# Altium schematic sheet STM32G473CET6_PINOUT.SchDoc
size C; SheetNumber: 8; SheetTotal: 9
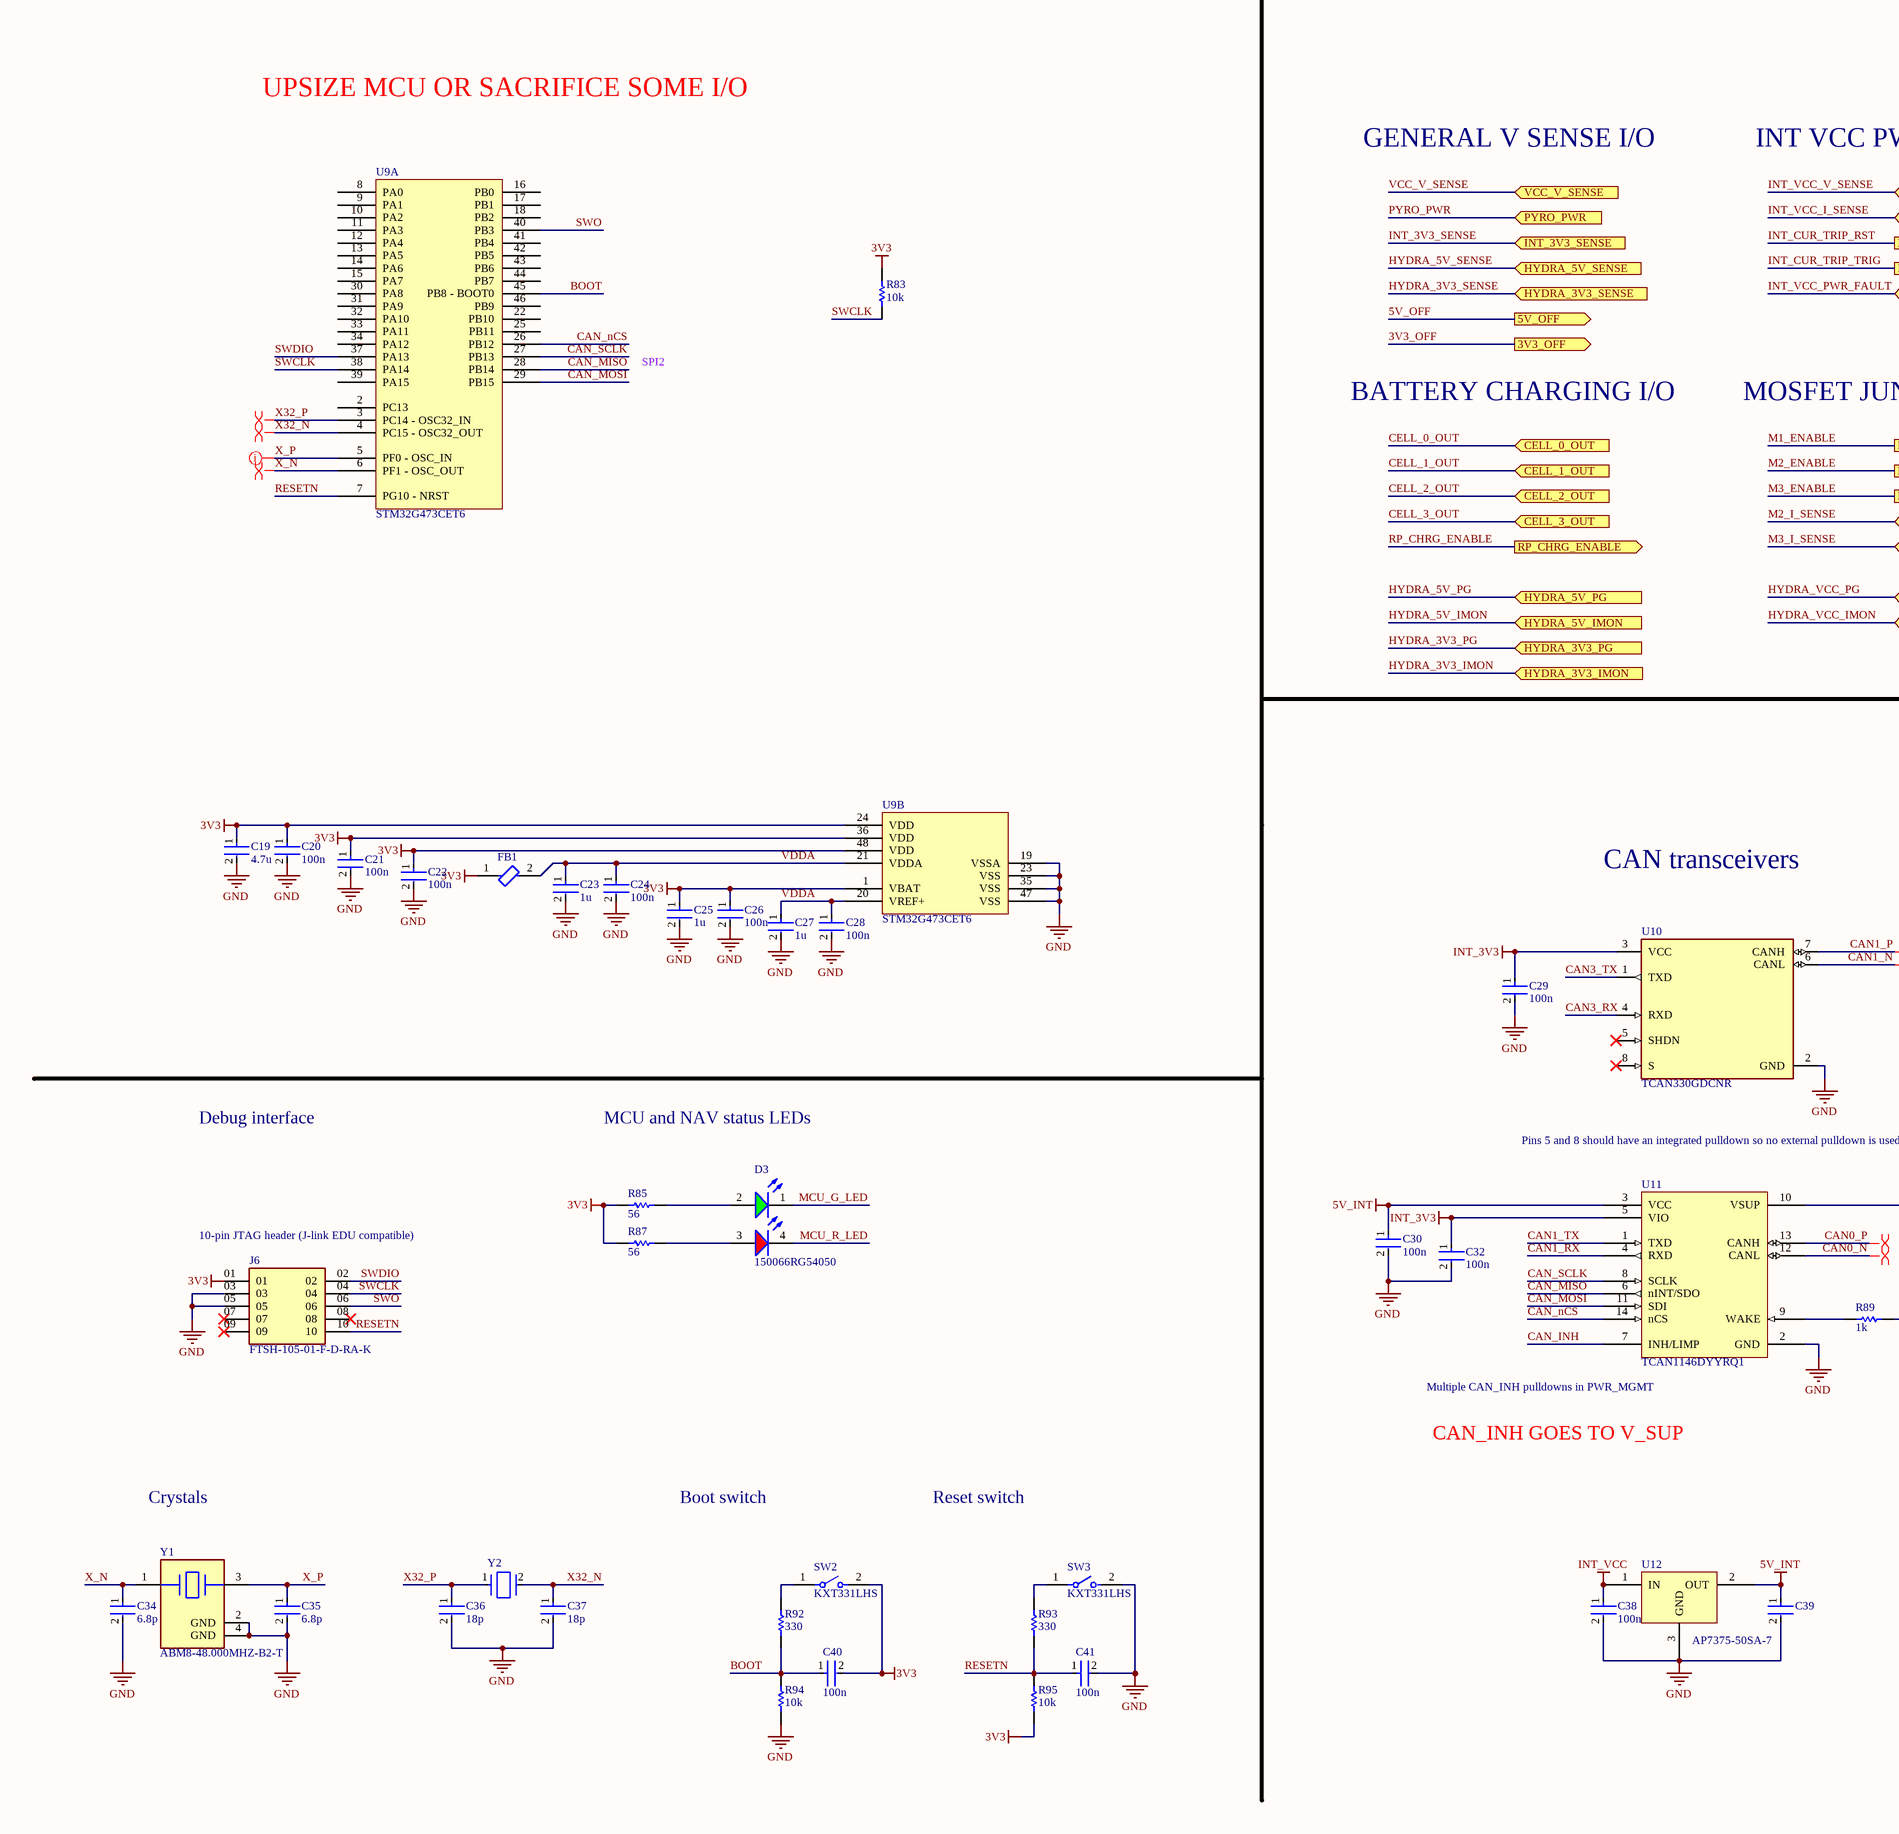
[diagram p0: STM32G473CET6_PINOUT.SchDoc, left]
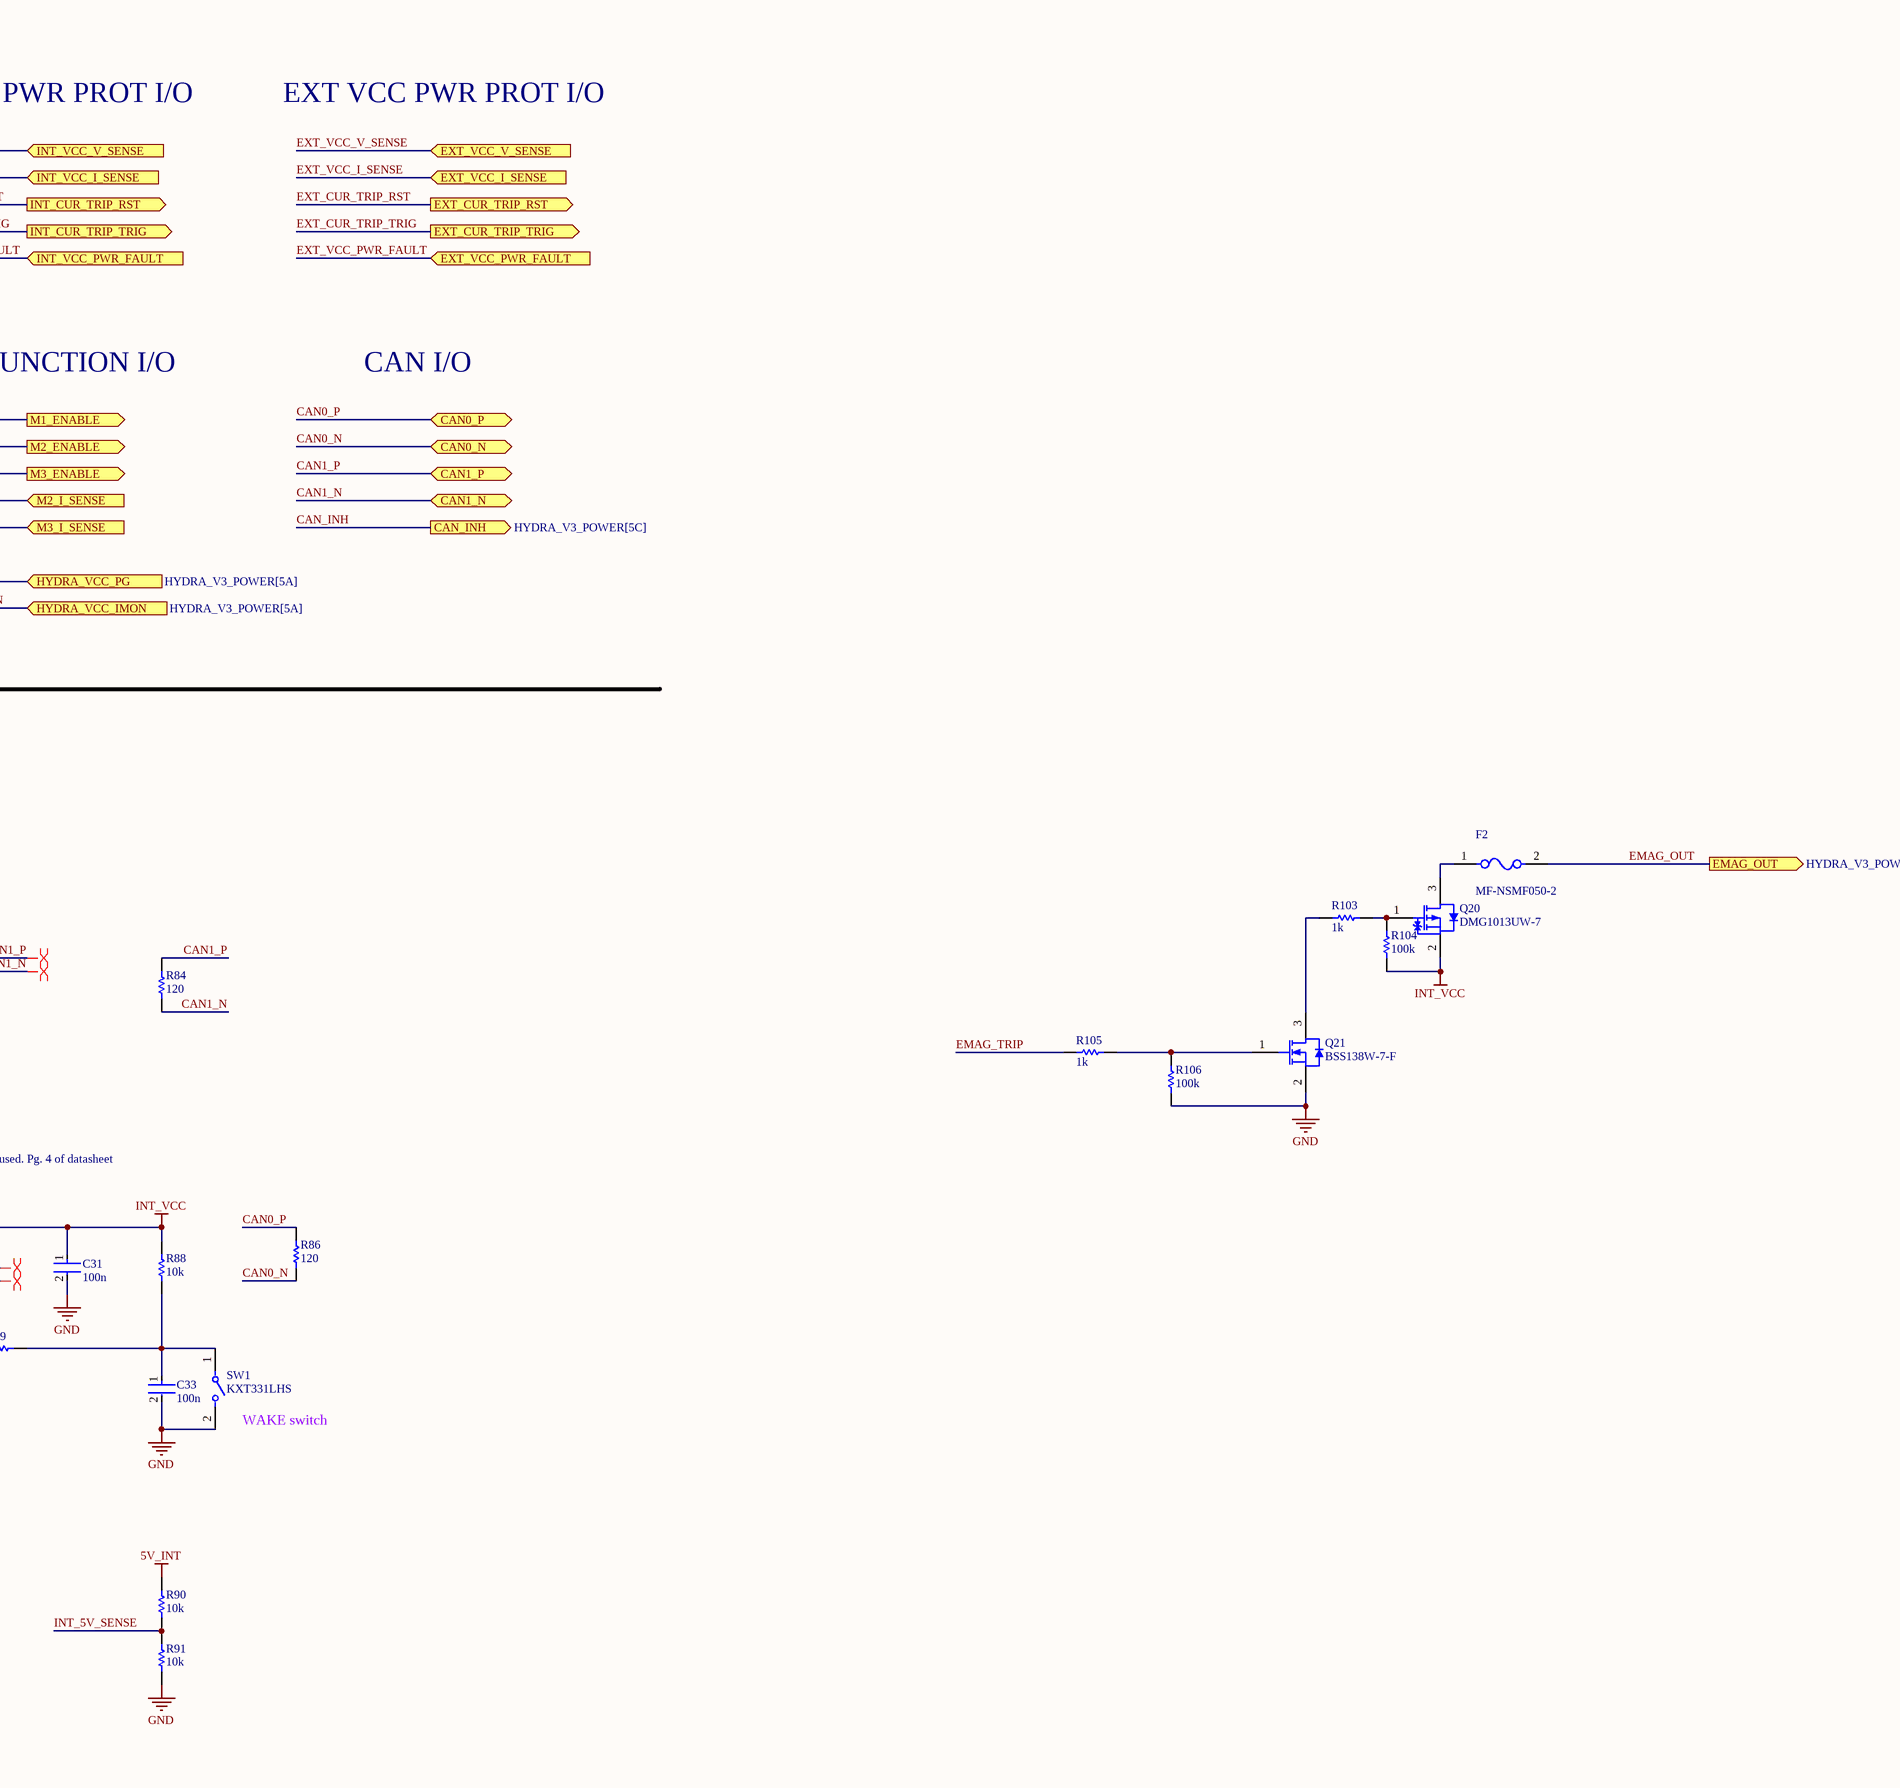
[diagram p1: STM32G473CET6_PINOUT.SchDoc, right]

## Parts
C19  4.7u  [FP-0402-L_1_0_0_05-W_0_5-IPC_A]
C20  100n  [FP-0402-L_1_0_0_05-W_0_5-IPC_A]
C21  100n  [FP-0402-L_1_0_0_05-W_0_5-IPC_A]
C22  100n  [FP-0402-L_1_0_0_05-W_0_5-IPC_A]
C23  1u  [FP-0402-L_1_0_0_05-W_0_5-IPC_A]
C24  100n  [FP-0402-L_1_0_0_05-W_0_5-IPC_A]
C25  1u  [FP-0402-L_1_0_0_05-W_0_5-IPC_A]
C26  100n  [FP-0402-L_1_0_0_05-W_0_5-IPC_A]
C27  1u  [FP-0402-L_1_0_0_05-W_0_5-IPC_A]
C28  100n  [FP-0402-L_1_0_0_05-W_0_5-IPC_A]
C29  100n  [FP-0402-L_1_0_0_05-W_0_5-IPC_A]
C30  100n  [FP-0402-L_1_0_0_05-W_0_5-IPC_A]
C31  100n  [FP-0402-L_1_0_0_05-W_0_5-IPC_A]
C32  100n  [FP-0402-L_1_0_0_05-W_0_5-IPC_A]
C33  100n  [FP-0402-L_1_0_0_05-W_0_5-IPC_A]
C34  6.8p  [FP-0402-L_1_0_0_05-W_0_5-IPC_A]
C35  6.8p  [FP-0402-L_1_0_0_05-W_0_5-IPC_A]
C36  18p  [FP-0402-L_1_0_0_05-W_0_5-IPC_A]
C37  18p  [FP-0402-L_1_0_0_05-W_0_5-IPC_A]
C38  100n  [FP-0402-L_1_0_0_05-W_0_5-IPC_A]
C39  CL05A106MP5NUNC  [FP-CL05A106MP5NUNC-MFG]  (value not drawn)
C40  100n  [FP-0402-L_1_0_0_05-W_0_5-IPC_A]
C41  100n  [FP-0402-L_1_0_0_05-W_0_5-IPC_A]
D3  150066RG54050  [WL-SBCD_0606]
F2  MF-NSMF050-2  [FP-MF-NSMF050-2-MFG]
FB1  BLM15PX601SN1D  [FP-BLM15-0_05-MFG]  (value not drawn)
J6  FTSH-105-01-F-D-RA-K  [FTSH-105-01-F-D-RA-K-Footprint-1]
Q20  DMG1013UW-7  [DIOD-SOT323-3_V]
Q21  BSS138W-7-F  [DIOD-SOT323-3_V]
R83  10k  [R0603B]
R84  120  [R0603B]
R85  56  [R0603B]
R86  120  [R0603B]
R87  56  [R0603B]
R88  10k  [R0603B]
R89  1k  [R0603B]
R90  10k  [R0603B]
R91  10k  [R0603B]
R92  330  [R0603B]
R93  330  [R0603B]
R94  10k  [R0603B]
R95  10k  [R0603B]
R103  1k  [R0603B]
R104  100k  [R0603B]
R105  1k  [R0603B]
R106  100k  [R0603B]
SW1  KXT331LHS  [FP-KXT331LHS-MFG]
SW2  KXT331LHS  [FP-KXT331LHS-MFG]
SW3  KXT331LHS  [FP-KXT331LHS-MFG]
U9  STM32G473CET6  [TSQFP50P900X900X160-48N]  (parts A,B of 2)
U10  TCAN330GDCNR  [FP-DCN0008A-MFG]
U11  TCAN1146DYYRQ1  [TCAN1146DYYRQ1-Footprint-1]
U12  AP7375-50SA-7  [AP7375-50SA-7-Footprint-1]
Y1  ABM8-48.000MHZ-B2-T  [FP-ABM8-MFG]
Y2  ECS-.327-12.5-1210-TR  [FP-ECX-1210-MFG]  (value not drawn)

## Ports
3V3_OFF (out, see HYDRA_V3_POWER[5B], HYDRA_REGULATORS[1A]), 5V_OFF (out, see HYDRA_V3_POWER[5B], HYDRA_REGULATORS[1A]), CAN0_N (bidir, see HYDRA_V3_POWER[5C]), CAN0_P (bidir, see HYDRA_V3_POWER[5C]), CAN1_N (bidir, see HYDRA_V3_POWER[5C]), CAN1_P (bidir, see HYDRA_V3_POWER[5C]), CAN_INH (out, see HYDRA_V3_POWER[5C]), CELL_0_OUT (in, see HYDRA_V3_POWER[5C], CELL_SENSE[4A]), CELL_1_OUT (in, see HYDRA_V3_POWER[5C], CELL_SENSE[4A]), CELL_2_OUT (in, see HYDRA_V3_POWER[5C], CELL_SENSE[4A]), CELL_3_OUT (in, see HYDRA_V3_POWER[5C], CELL_SENSE[4A]), EMAG_OUT (out, see HYDRA_V3_POWER[5C]), EXT_CUR_TRIP_RST (out, see HYDRA_V3_POWER[5C]), EXT_CUR_TRIP_TRIG (out, see HYDRA_V3_POWER[5C]), EXT_VCC_I_SENSE (in, see HYDRA_V3_POWER[5C]), EXT_VCC_PWR_FAULT (in, see HYDRA_V3_POWER[5C]), EXT_VCC_V_SENSE (in, see HYDRA_V3_POWER[5C]), HYDRA_3V3_IMON (in, see HYDRA_V3_POWER[5B]), HYDRA_3V3_PG (in, see HYDRA_V3_POWER[5B]), HYDRA_3V3_SENSE (in, see HYDRA_V3_POWER[5B]), HYDRA_5V_IMON (in, see HYDRA_V3_POWER[5B]), HYDRA_5V_PG (in, see HYDRA_V3_POWER[5B]), HYDRA_5V_SENSE (in, see HYDRA_V3_POWER[5B]), HYDRA_VCC_IMON (in, see HYDRA_V3_POWER[5A]), HYDRA_VCC_PG (in, see HYDRA_V3_POWER[5A]), INT_3V3_SENSE (in, see HYDRA_V3_POWER[5A], INT_REG[3B]), INT_CUR_TRIP_RST (out, see HYDRA_V3_POWER[5B]), INT_CUR_TRIP_TRIG (out, see HYDRA_V3_POWER[5B]), INT_VCC_I_SENSE (in, see HYDRA_V3_POWER[5B]), INT_VCC_PWR_FAULT (in, see HYDRA_V3_POWER[5B]), INT_VCC_V_SENSE (in, see HYDRA_V3_POWER[5B]), M1_ENABLE (out, see HYDRA_V3_POWER[5B]), M2_ENABLE (out, see HYDRA_V3_POWER[5B]), M2_I_SENSE (in, see HYDRA_V3_POWER[5C], MOSFET_JUNCTION[5A]), M3_ENABLE (out, see HYDRA_V3_POWER[5B]), M3_I_SENSE (in, see HYDRA_V3_POWER[5C], MOSFET_JUNCTION[5C]), PYRO_PWR (in, see HYDRA_V3_POWER[5A]), RP_CHRG_ENABLE (out, see HYDRA_V3_POWER[5C]), VCC_V_SENSE (in, see HYDRA_V3_POWER[5A], INT_REG[3C])

## Nets
3V3: C19.1 C20.1 C21.1 C22.1 C25.1 C26.1 C40.2 FB1.1 J6.01 R83.2 R85.2 R87.2 R95.1 SW2.2 U9.1(VBAT) U9.24(VDD) U9.36(VDD) U9.48(VDD)
5V_INT: C30.1 C39.1 R90.2 U11.3(VCC) U12.2(OUT)
GND: C19.2 C20.2 C21.2 C22.2 C23.2 C24.2 C25.2 C26.2 C27.2 C28.2 C29.2 C30.2 C31.2 C32.2 C33.2 C34.2 C35.2 C36.2 C37.2 C38.2 C39.2 C41.2 J6.03 J6.05 Q21.2(S) R91.1 R94.1 R106.1 SW1.2 SW3.2 U9.19(VSSA) U9.23(VSS) U9.35(VSS) U9.47(VSS) U10.2(GND) U11.2(GND) U12.3(GND) Y1.2(GND) Y1.4(GND)
INT_3V3: C29.1 C32.1 U10.3(VCC) U11.5(VIO)
INT_VCC: C31.1 C38.1 Q20.2(S) R88.2 R104.2 U11.10(VSUP) U12.1(IN)
3V3_OFF: port 3V3_OFF
5V_OFF: port 5V_OFF
BOOT: C40.1 R92.1 R94.2 U9.45(PB8_-_BOOT0)
CAN0_N: R86.1 U11.12(CANL) ; port CAN0_N
CAN0_P: R86.2 U11.13(CANH) ; port CAN0_P
CAN1_N: R84.1 U10.6(CANL) ; port CAN1_N
CAN1_P: R84.2 U10.7(CANH) ; port CAN1_P
CAN1_RX: U11.4(RXD)
CAN1_TX: U11.1(TXD)
CAN3_RX: U10.4(RXD)
CAN3_TX: U10.1(TXD)
CAN_INH: U11.7(INH/LIMP) ; port CAN_INH
CAN_MISO: U9.28(PB14) U11.6(nINT/SDO)
CAN_MOSI: U9.29(PB15) U11.11(SDI)
CAN_nCS: U9.26(PB12) U11.14(nCS)
CAN_SCLK: U9.27(PB13) U11.8(SCLK)
CELL_0_OUT: port CELL_0_OUT
CELL_1_OUT: port CELL_1_OUT
CELL_2_OUT: port CELL_2_OUT
CELL_3_OUT: port CELL_3_OUT
EMAG_OUT: F2.2 ; port EMAG_OUT
EMAG_TRIP: R105.2
EXT_CUR_TRIP_RST: port EXT_CUR_TRIP_RST
EXT_CUR_TRIP_TRIG: port EXT_CUR_TRIP_TRIG
EXT_VCC_I_SENSE: port EXT_VCC_I_SENSE
EXT_VCC_PWR_FAULT: port EXT_VCC_PWR_FAULT
EXT_VCC_V_SENSE: port EXT_VCC_V_SENSE
HYDRA_3V3_IMON: port HYDRA_3V3_IMON
HYDRA_3V3_PG: port HYDRA_3V3_PG
HYDRA_3V3_SENSE: port HYDRA_3V3_SENSE
HYDRA_5V_IMON: port HYDRA_5V_IMON
HYDRA_5V_PG: port HYDRA_5V_PG
HYDRA_5V_SENSE: port HYDRA_5V_SENSE
HYDRA_VCC_IMON: port HYDRA_VCC_IMON
HYDRA_VCC_PG: port HYDRA_VCC_PG
INT_3V3_SENSE: port INT_3V3_SENSE
INT_5V_SENSE: R90.1 R91.2
INT_CUR_TRIP_RST: port INT_CUR_TRIP_RST
INT_CUR_TRIP_TRIG: port INT_CUR_TRIP_TRIG
INT_VCC_I_SENSE: port INT_VCC_I_SENSE
INT_VCC_PWR_FAULT: port INT_VCC_PWR_FAULT
INT_VCC_V_SENSE: port INT_VCC_V_SENSE
M1_ENABLE: port M1_ENABLE
M2_ENABLE: port M2_ENABLE
M2_I_SENSE: port M2_I_SENSE
M3_ENABLE: port M3_ENABLE
M3_I_SENSE: port M3_I_SENSE
MCU_G_LED: D3.1(K)
MCU_R_LED: D3.4(K)
PYRO_PWR: port PYRO_PWR
RESETN: C41.1 J6.10 R93.1 R95.2 U9.7(PG10_-_NRST)
RP_CHRG_ENABLE: port RP_CHRG_ENABLE
SWCLK: J6.04 R83.1 U9.38(PA14)
SWDIO: J6.02 U9.37(PA13)
SWO: J6.06 U9.40(PB3)
VCC_V_SENSE: port VCC_V_SENSE
VDDA: C23.1 C24.1 C27.1 C28.1 FB1.2 U9.20(VREF+) U9.21(VDDA)
X32_N: C37.1 U9.4(PC15_-_OSC32_OUT) Y2.2(Out/In)
X32_P: C36.1 U9.3(PC14_-_OSC32_IN) Y2.1(In/Out)
X_N: C34.1 U9.6(PF1_-_OSC_OUT) Y1.1
X_P: C35.1 U9.5(PF0_-_OSC_IN) Y1.3
NetC33_1: C33.1 R88.1 R89.1 SW1.1
NetD3_2: D3.2(A) R85.1
NetD3_3: D3.3(A) R87.1
NetF2_1: F2.1 Q20.3(D)
NetQ20_1: Q20.1(G) R103.1 R104.1
NetQ21_1: Q21.1(G) R105.1 R106.2
NetQ21_3: Q21.3(D) R103.2
NetR89_2: R89.2 U11.9(WAKE)
NetR92_2: R92.2 SW2.1
NetR93_2: R93.2 SW3.1

Not connected (* = marked no-connect by the designer): J6 07* 08* 09*; U9 2(PC13) 8(PA0) 9(PA1) 10(PA2) 11(PA3) 12(PA4) 13(PA5) 14(PA6) 15(PA7) 16(PB0) 17(PB1) 18(PB2) 22(PB10) 25(PB11) 30(PA8) 31(PA9) 32(PA10) 33(PA11) 34(PA12) 39(PA15) 41(PB4) 42(PB5) 43(PB6) 44(PB7) 46(PB9); U10 5(SHDN)* 8(S)*

## Layout directives
differential pair: CAN1_N, CAN1_P, X32_N, X32_P, X_N, X_P
differential pair; differential pair class 120DIFF: CAN0_N, CAN0_P

## Notes on the sheet
- UPSIZE MCU OR SACRIFICE SOME I/O
- GENERAL V SENSE I/O
- INT VCC PWR PROT I/O
- EXT VCC PWR PROT I/O
- SPI2
- BATTERY CHARGING I/O
- MOSFET JUNCTION I/O
- CAN I/O
- CAN transceivers
- Debug interface
- MCU and NAV status LEDs
- Pins 5 and 8 should have an integrated pulldown so no external pulldown is used. Pg. 4 of datasheet
- (near J6) 10-pin JTAG header (J-link EDU compatible)
- (near U11) Multiple CAN_INH pulldowns in PWR_MGMT
- (near SW1) WAKE switch
- CAN_INH GOES TO V_SUP
- Crystals
- Boot switch
- Reset switch

## Library data of the parts
C19-C38 C40 C41 = CMP-001-00058-1: LARGE PADS, 0402 CAP, CHANGE COMMENT TO MATCH REAL P/N; Capacitor Type: Ceramic; Min Operating Temperature: -55°C; Mounting Technology: Surface Mount; Pins: 2; Case/Package: 0402; RoHS Compliant: Yes; Max Operating Temperature: 85°C
C39 = CMP-13271-000002-1: CAP CER 10UF 10V X5R 0402; Manufacturer: Samsung; Temperature Coefficient: 15%; Tolerance: 20%; Material: Ceramic; Octopart: https://octopart.com/cl05a106mp5nunc-samsung-22457395; Voltage Rating: 10V; RoHS: TRUE; Value: 10uF; Height: 0.7mm; Digikey Description: CAP CER 10UF 10V X5R 0402; Automotive: No; Package: CL05A106MP5NUNC; Device Class L1: Passive Components; Capacitance: 10uF; Temperature Range High: +85°C; ComponentLink2Description: Datasheet; Device Class L2: Capacitors; Temperature Characteristic: X5R; Manufacturer Part Number: CL05A106MP5NUNC; Temperature: -55°C to +85°C; ComponentLink2URL: http://www.samsungsem.com/kr/support/product-search/mlcc/__icsFiles/afieldfile/2019/05/10/19-CL05A106MP5NUNC.pdf; Device Class L3: Ceramic Capacitors; Category: Cap; Temperature Range Low: -55°C; Ipc Land Pattern Name: CAPC10050X50; Lead Free: Yes
D3 = CMP-004-00040-2: Led, Red/Grn, 180Mcd/230Mcd, 624Nm/525Nm Rohs Compliant: Yes; Source: rgled.SchLib; Component Type: Standard; Design Item ID: CMP-004-00034-2; Pins: 4
F2 = CMP-07400-000036-1: PTC RESET FUSE 13.2V 500MA 1206; Manufacturer: Bourns; Resistance: 0.15-0.7Ω; Hold Current: 0.5A; Trip Current: 1A; Current Rating: 100A; Value: 0.15-0.7Ω; Automotive Grade: Grade 3; Trip Time: 0.1s; Temperature Range Low: -40°C; Temperature: -40°C to +85°C; Digikey Description: PTC RESET FUSE 13.2V 500MA 1206; Ambient Temperature Range Low: -40°C; RoHS: TRUE; Device Class L2: PTC Resettable Fuses; Octopart: https://octopart.com/mf-nsmf050-2-bourns-34532; ComponentLink2Description: Datasheet; Voltage Rating: 13.2V; Category: Fuse; ComponentLink2URL: https://www.bourns.com/docs/product-datasheets/mfnsmf.pdf?sfvrsn=39c76af6_14; Mouser Description: Resettable Fuses - PPTC 0.50A 13.2V 0.15ohm 1206 Footprint; Temperature Range High: +85°C; Device Class L1: Circuit Protection; Device Class L3: unset; Automotive: Yes; Package: MF-NSMF050-2; Ambient Temperature Range High: +85°C; Height: 0.85mm; Manufacturer Part Number: MF-NSMF050-2; Lead Free: Yes
FB1 = CMP-0686-00252-4: Chip Ferrite Bead, 0402, 600Ω @ 100MHz, 0.23Ω, 25%, 900mA; Number of Circuits: 1; Impedance: 600R; DC Resistance (DCR): 230mR; Material: Steel; Length: 1mm; Package Quantity: 10000; Height: 0.5mm; Width: 0.5mm; Max DC Current: 900mA; Number of Lines: 1; Termination: SMD/SMT; Packaging: Tape and Reel; Lead Free: Lead Free; Min Operating Temperature: -55°C; Max Operating Temperature: 125°C; Max Current Rating: 900mA; Case Code (Imperial): 0402; Number of Pins: 2; Current Rating: 900mA; Test Frequency: 100MHz; Case/Package: 0402; Tolerance: 25%; Case Code (Metric): 1005
J6 = CMP-002-00041-5: Board Connector, 10 Contact(s), 2 Row(s), Male, Right Angle, 0.05 inch Pitch, Surface Mount Terminal, Locking, Black Insulator; Connector Type: BOARD CONNECTOR; Mounting Technology: Board; RoHS Compliant: Yes
Q20 = CMP-2000-06170-1: P-Channel Enhancement Mode MOSFET, 310 mW, 20 V, -55 to 150 degC, 3-Pin SOT-323, RoHS, Tape and Reel; Manufacturer: Diodes Inc; Qg Gate Charge: 0.622nC; Drain-Source On Resistance-Max: 750mO; Rated Power Dissipation: 310mW; Drain-to-Source Voltage [Vdss]: 20V; Package Reference: SOT323; Datasheet Version: Rev. 3-2, 09/2013; Package Description: 3-Pin Small Outline Transistor, Body 2 x 1.25 mm, Pitch 0.65 mm; Mounting Technology: SurfaceMount; Manufacturer URL: http://www.diodes.com/; Datasheet URL: http://www.diodes.com/_files/datasheets/ds31861.pdf; Channel Type: P-Channel
Q21 = CMP-2000-05968-1: N-Channel Enhancement Mode Mosfet, 50 V, 200 mA, -55 to 150 degC, 6-Pin SOT-323, RoHS, Tape and Reel; Typical Turn-Off Delay Time: 20ns; Number of Channels: 1Channel; Type: EnhancementModeFieldEffectTransistor; Brand: DiodesIncorporated; Vds - Drain-Source Breakdown Voltage: 75V; Vgs - Gate-Source Voltage: 20V; Rds On - Drain-Source Resistance: 1.4Ohms; Transistor Type: 1N-Channel; Configuration: Single; Unit Weight: 0.000212oz; Pd - Power Dissipation: 200mW; Id - Continuous Drain Current: 200mA; Forward Transconductance - Min: 0.1S; Manufacturer URL: http://www.diodes.com/; Series: BSS138; Package Description: 3-Pin Small Outline Transistor, Body 2 x 1.25 mm, Pitch 0.65 mm; Mounting Technology: SurfaceMount; Product Category: MOSFET; RoHS: True; Maximum Operating Temperature: +150C; Height: 1mm; Length: 2.2mm; Technology: Si; Width: 1.35mm; Datasheet URL: http://www.diodes.com/_files/datasheets/ds30206.pdf; Manufacturer: DiodesIncorporated; Package / Case: SOT-323-3; Typical Turn-On Delay Time: 20ns; Transistor Polarity: N-Channel; Factory Pack Quantity: 3000; Packaging: Reel; Product: MOSFETSmallSignal; Datasheet Version: Rev. 11-2, 09/2013; Package Reference: SOT323; Minimum Operating Temperature: -55C; Mounting Style: SMD/SMT; Channel Mode: Enhancement
R83-R95 R103-R106 = CMP-009-00002-14: Resistor
SW1-SW3 = CMP-10040-000029-1: SWITCH TACTILE SPST-NO 0.02A 15V; Operating Force: 240gf; Switch Travel: 0.13mm; Illumination Type: Non-Illuminated; Throw Configuration: SPST; Number of Ports: 1; Current Rating: 5A; Mechanical Life: 500000Cycles; Switch Function: Off-Mom; Connector Type: USB; Actuator Type: Standard; Gender: Receptacle; Number of Contacts: 24; Contact Plating: Gold; Insulation Color: Black; Min Operating Temperature: -40°C; Packaging: Tape and Reel; Flammability Rating: UL94 V-0; Max Operating Temperature: 85°C; Termination: Solder; Mount: Surface Mount
U9 = CMP-020-00018-2: RISC Microcontroller, 32-Bit, 170MHz; RoHS Compliant: Yes
U10 = CMP-04872-000178-1: IC TRANSCEIVER 1/1 SOT23-8; Data Rate: 1Mbps; Packaging: Tape and Reel; Min Operating Temperature: -40°C; Max Operating Temperature: 125°C; RoHS Compliant: Yes; Lead Free: Lead Free; Case/Package: SOT-23-8; Mount: Surface Mount
U11 = CMP-318-000000-2: Automotive CAN FD transceiver with watchdog, bus diagnostics and partial networking via sele 14-SOT-23-THIN -40 to 150; Component Type: Standard; Design Item ID: CMP-015-00012-2; Pin Count: 14; Source: TCAN1146DYYRQ1.SchLib
U12 = CMP-019-00041-1: Ldo Cmos Lowcurr SOT23 T&r 3K
Y1 = CMP-27762-011708-1: Crystal 48MHz ±20ppm 18pF SMD-4 3.2mm x 2.5mm; Series Resistance: 35R; Frequency Stability: 50ppm; Package Quantity: 1000; Packaging: Tape and Reel; Mount: Surface Mount; Length: 3.2mm; Load Capacitance: 18pF; Max Operating Temperature: 70°C; Operating Frequency: 48 MHz; RoHS Compliant: Yes; Series: ABM8; Frequency Tolerance: 20ppm; Lead Free: Lead Free; Min Operating Temperature: -20°C; Case/Package: CSMD; Number of Pins: 4; Height: 0.031inch; ESR (Equivalent Series Resistance): 35R; Frequency: 48MHz; Radiation Hardening: No; Width: 0.098inch; Tolerance: 20ppm; Termination: SMD/SMT; Depth: 2.5mm; Resistor Type: Ceramic; REACH SVHC: No SVHC
Y2 = CMP-40224-000006-1: CRYSTAL 32.7680KHZ 12.5PF SMD; Manufacturer: ECS International; Frequency: 32.768kHz; Esr: 90kΩ; Tolerance: 20ppm; Device Class L1: Passive Components; Load Capacitance: 12.5pF; Temperature: -40°C to +85°C; ComponentLink2URL: https://ecsxtal.com/store/pdf/ECX-1210.pdf; Series: ECX-1210; Octopart: https://octopart.com/ecs-.327-12.5-1210-tr-ecs+international-81221340; ComponentLink2Description: Datasheet; Temperature Range Low: -40°C; Digikey Description: CRYSTAL 32.7680KHZ 12.5PF SMD; Lead Free: Yes; RoHS: TRUE; Device Class L3: Crystals; Automotive: No; Category: Crys; Height: 0.5mm; Manufacturer Part Number: ECS-.327-12.5-1210-TR; Temperature Range High: +85°C; Device Class L2: Crystals / Oscillators; Package: ECX-1210